# Altium schematic sheet Inputs.SchDoc
size A4
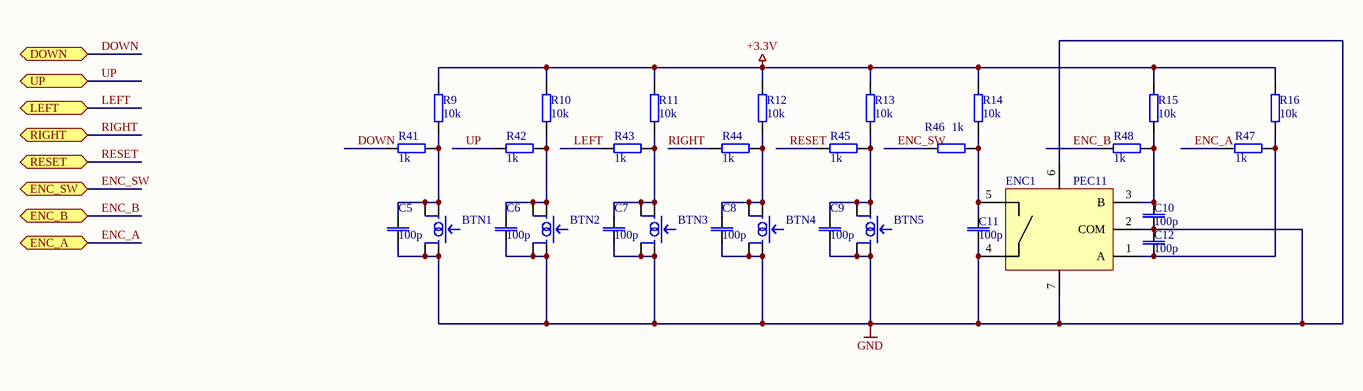
[diagram p0: Inputs.SchDoc]

## Parts
BTN1  (no value)  [PBUTTON_SMD]
BTN2  (no value)  [PBUTTON_SMD]
BTN3  (no value)  [PBUTTON_SMD]
BTN4  (no value)  [PBUTTON_SMD]
BTN5  (no value)  [PBUTTON_SMD]
C5  100p  [CAP 0805]
C6  100p  [CAP 0805]
C7  100p  [CAP 0805]
C8  100p  [CAP 0805]
C9  100p  [CAP 0805]
C10  100p  [CAP 0805]
C11  100p  [CAP 0805]
C12  100p  [CAP 0805]
ENC1  PEC11  [PEC11]
R9  10k  [RES 0805]
R10  10k  [RES 0805]
R11  10k  [RES 0805]
R12  10k  [RES 0805]
R13  10k  [RES 0805]
R14  10k  [RES 0805]
R15  10k  [RES 0805]
R16  10k  [RES 0805]
R41  1k  [RES 0805]
R42  1k  [RES 0805]
R43  1k  [RES 0805]
R44  1k  [RES 0805]
R45  1k  [RES 0805]
R46  1k  [RES 0805]
R47  1k  [RES 0805]
R48  1k  [RES 0805]

## Ports
DOWN (bidir), ENC_A (bidir), ENC_B (bidir), ENC_SW (bidir), LEFT (bidir), RESET (bidir), RIGHT (bidir), UP (bidir)

## Nets
+3.3V: R9.2 R10.2 R11.2 R12.2 R13.2 R14.2 R15.2 R16.2
GND: BTN1.1 BTN1.2 BTN2.1 BTN2.2 BTN3.1 BTN3.2 BTN4.1 BTN4.2 BTN5.1 BTN5.2 C5.1 C6.1 C7.1 C8.1 C9.1 C10.1 C11.1 C12.2 ENC1.2(COM) ENC1.4 ENC1.6 ENC1.7
DOWN: R41.1 ; port DOWN
ENC_A: R47.1 ; port ENC_A
ENC_B: R48.1 ; port ENC_B
ENC_SW: R46.1 ; port ENC_SW
LEFT: R43.1 ; port LEFT
RESET: R45.1 ; port RESET
RIGHT: R44.1 ; port RIGHT
UP: R42.1 ; port UP
NetBTN1_3: BTN1.3 BTN1.4 C5.2 R9.1 R41.2
NetBTN2_3: BTN2.3 BTN2.4 C6.2 R10.1 R42.2
NetBTN3_3: BTN3.3 BTN3.4 C7.2 R11.1 R43.2
NetBTN4_3: BTN4.3 BTN4.4 C8.2 R12.1 R44.2
NetBTN5_3: BTN5.3 BTN5.4 C9.2 R13.1 R45.2
NetC10_2: C10.2 ENC1.3(B) R15.1 R48.2
NetC11_2: C11.2 ENC1.5 R14.1 R46.2
NetC12_1: C12.1 ENC1.1(A) R16.1 R47.2

## Library data of the parts
BTN1-BTN5 = PUSHBUTTON: Tactile push button; Datasheet: http://www.farnell.com/datasheets/2706291.pdf
C5-C12 = CAP: NON POLARIZED CAPACITOR; VALUE: 100p; Reference: 82-01-25; Supplier: LOMEX
ENC1 = PEC11: Mechanical rotary encoder with pushbutton; Name: PEC11; Datasheet: https://www.bourns.com/data/global/pdfs/PEC11_obsolete.pdf
R9-R16 R41-R48 = RES: RESISTOR; Reference: 81-10-99; Supplier: LOMEX
  R9-R16: VALUE: 10k
  R41-R48: VALUE: 1k